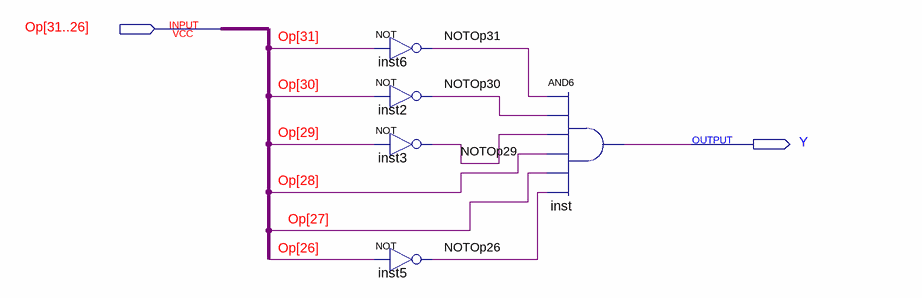
[diagram p0: schematic sheet]
// Quartus schematic BLEZ.bdf as structural Verilog: 5 symbols, 2 pins
module BLEZ (
  input  [31:26] Op,
  output Y
);

  wire NOTOp26, NOTOp29, NOTOp30, NOTOp31;

  not inst6 (NOTOp31, Op[31]);
  not inst2 (NOTOp30, Op[30]);
  not inst3 (NOTOp29, Op[29]);
  not inst5 (NOTOp26, Op[26]);
  and inst (Y, NOTOp31, NOTOp30, NOTOp29, Op[28], Op[27], NOTOp26);
endmodule
